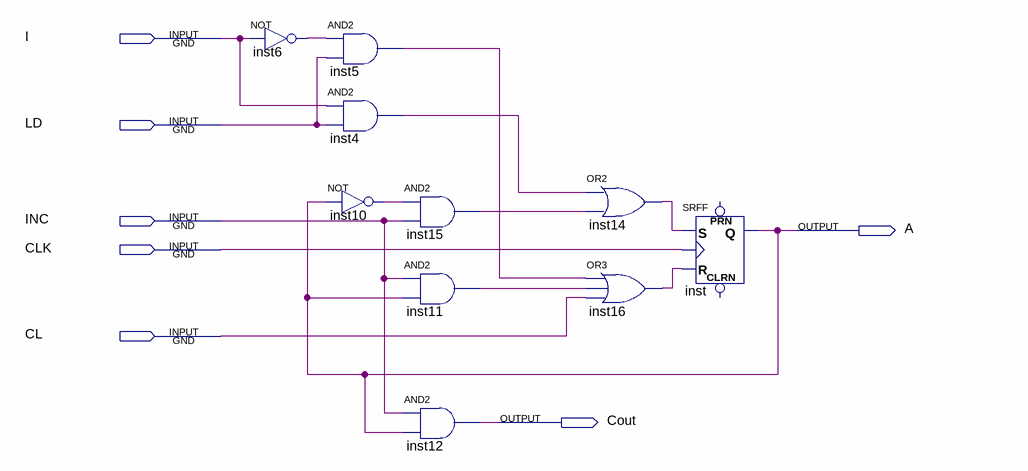
[diagram p0: schematic sheet]
// Quartus schematic reg1.bdf as structural Verilog: 10 symbols, 7 pins
module reg1 (
  input  I,
  input  LD,
  input  INC,
  input  CLK,
  input  CL,
  output A,
  output Cout
);

  wire inst4_out, inst5_out, inst6_out, inst10_out, inst11_out, inst14_out, inst15_out, inst16_out;

  not inst6 (inst6_out, I);
  and inst5 (inst5_out, inst6_out, LD);
  and inst4 (inst4_out, I, LD);
  not inst10 (inst10_out, A);
  and inst15 (inst15_out, inst10_out, INC);
  and inst11 (inst11_out, INC, A);
  and inst12 (Cout, INC, A);
  or inst14 (inst14_out, inst4_out, inst15_out);
  or inst16 (inst16_out, inst5_out, inst11_out, CL);
  SRFF inst (.S(inst14_out), .R(inst16_out), .CLK(CLK), .Q(A));  // open: PRN, CLRN
endmodule
